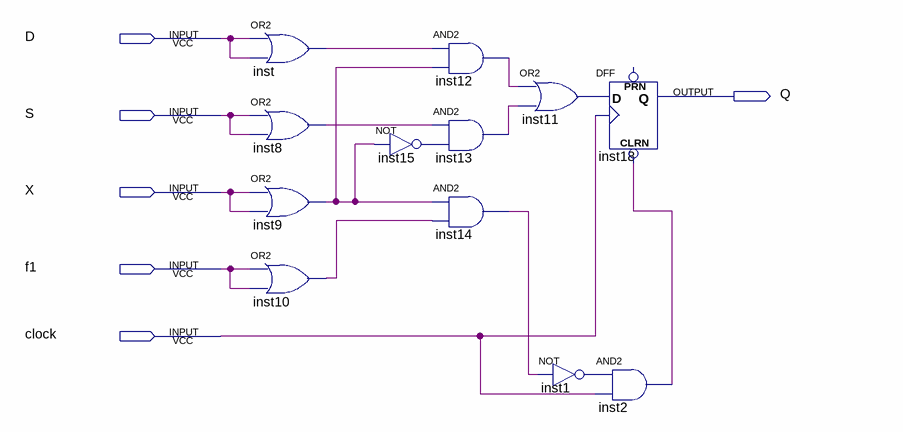
[diagram p0: schematic sheet]
// Quartus schematic rg_m.bdf as structural Verilog: 12 symbols, 6 pins
module rg_m (
  input  D,
  input  S,
  input  X,
  input  f1,
  input  clock,
  output Q
);

  wire inst1_out, inst2_out, inst8_out, inst9_out, inst10_out, inst11_out, inst12_out, inst13_out,
       inst14_out, inst15_out, inst_out;

  or inst (inst_out, D, D);
  or inst8 (inst8_out, S, S);
  or inst9 (inst9_out, X, X);
  or inst10 (inst10_out, f1, f1);
  not inst15 (inst15_out, inst9_out);
  and inst12 (inst12_out, inst_out, inst9_out);
  and inst13 (inst13_out, inst8_out, inst15_out);
  and inst14 (inst14_out, inst9_out, inst10_out);
  or inst11 (inst11_out, inst12_out, inst13_out);
  not inst1 (inst1_out, inst14_out);
  DFF inst18 (.CLRN(inst2_out), .CLK(clock), .D(inst11_out), .Q(Q));  // open: PRN
  and inst2 (inst2_out, inst1_out, clock);
endmodule
